# Altium project 测试板.PrjPcb
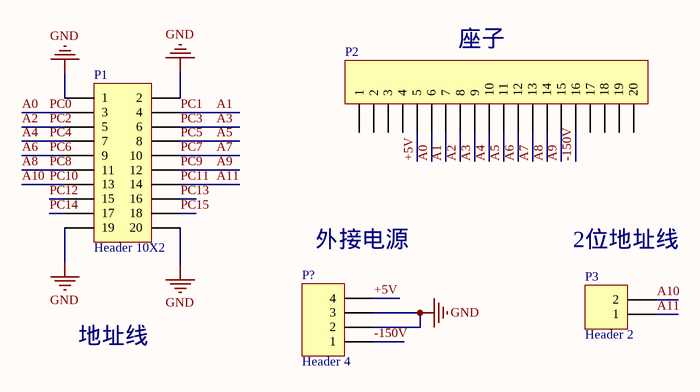
[diagram p0: 测试板.SchDoc]
1 sheet, 4 parts. Net scope: global (net labels, ports and power ports of the same name join across sheets).
Board file: 测试板.PcbDoc

## Sheet 测试板.SchDoc
size A4

### Parts
P1  Header 10X2  [IDC2.54-20P]
P2  Header 20  [51插座]  (value not drawn)
P3  Header 2  [HDR-1x2]
P?  Header 4  [HDR-1X4_H]

### Nets
GND: P1.1 P1.2 P1.19 P1.20 P?.2 P?.3
+5V: P2.5 P?.4
-150V: P2.16 P?.1
A0: P1.3 P2.6  [also labelled PC0]
A1: P1.4 P2.7  [also labelled PC1]
A2: P1.5 P2.8  [also labelled PC2]
A3: P1.6 P2.9  [also labelled PC3]
A4: P1.7 P2.10  [also labelled PC4]
A5: P1.8 P2.11  [also labelled PC5]
A6: P1.9 P2.12  [also labelled PC6]
A7: P1.10 P2.13  [also labelled PC7]
A8: P1.11 P2.14  [also labelled PC8]
A9: P1.12 P2.15  [also labelled PC9]
A10: P1.13 P3.2  [also labelled PC10]
A11: P1.14 P3.1  [also labelled PC11]
PC12: P1.15
PC13: P1.16
PC14: P1.17
PC15: P1.18

Not connected (* = marked no-connect by the designer): P2 1 2 3 4 17 18 19 20

### Notes on the sheet
- (near P2) 座子
- (near P?) 外接电源
- (near P3) 2位地址线
- 地址线

### Library data of the parts
P1 = Header 10X2: Header, 10-Pin, Dual row; LatestRevisionDate: 17-Jul-2002; LatestRevisionNote: Re-released for DXP Platform.; Publisher: Altium Limited
P2 = Header 20: Header, 20-Pin; LatestRevisionDate: 17-Jul-2002; LatestRevisionNote: Re-released for DXP Platform.; Publisher: Altium Limited
P3 = Header 2: Header, 2-Pin; LatestRevisionDate: 17-Jul-2002; LatestRevisionNote: Re-released for DXP Platform.; Publisher: Altium Limited
P? = Header 4: Header, 4-Pin; LatestRevisionDate: 17-Jul-2002; LatestRevisionNote: Re-released for DXP Platform.; Publisher: Altium Limited